# EAGLE board ms2 (EAGLE 6.5.0)
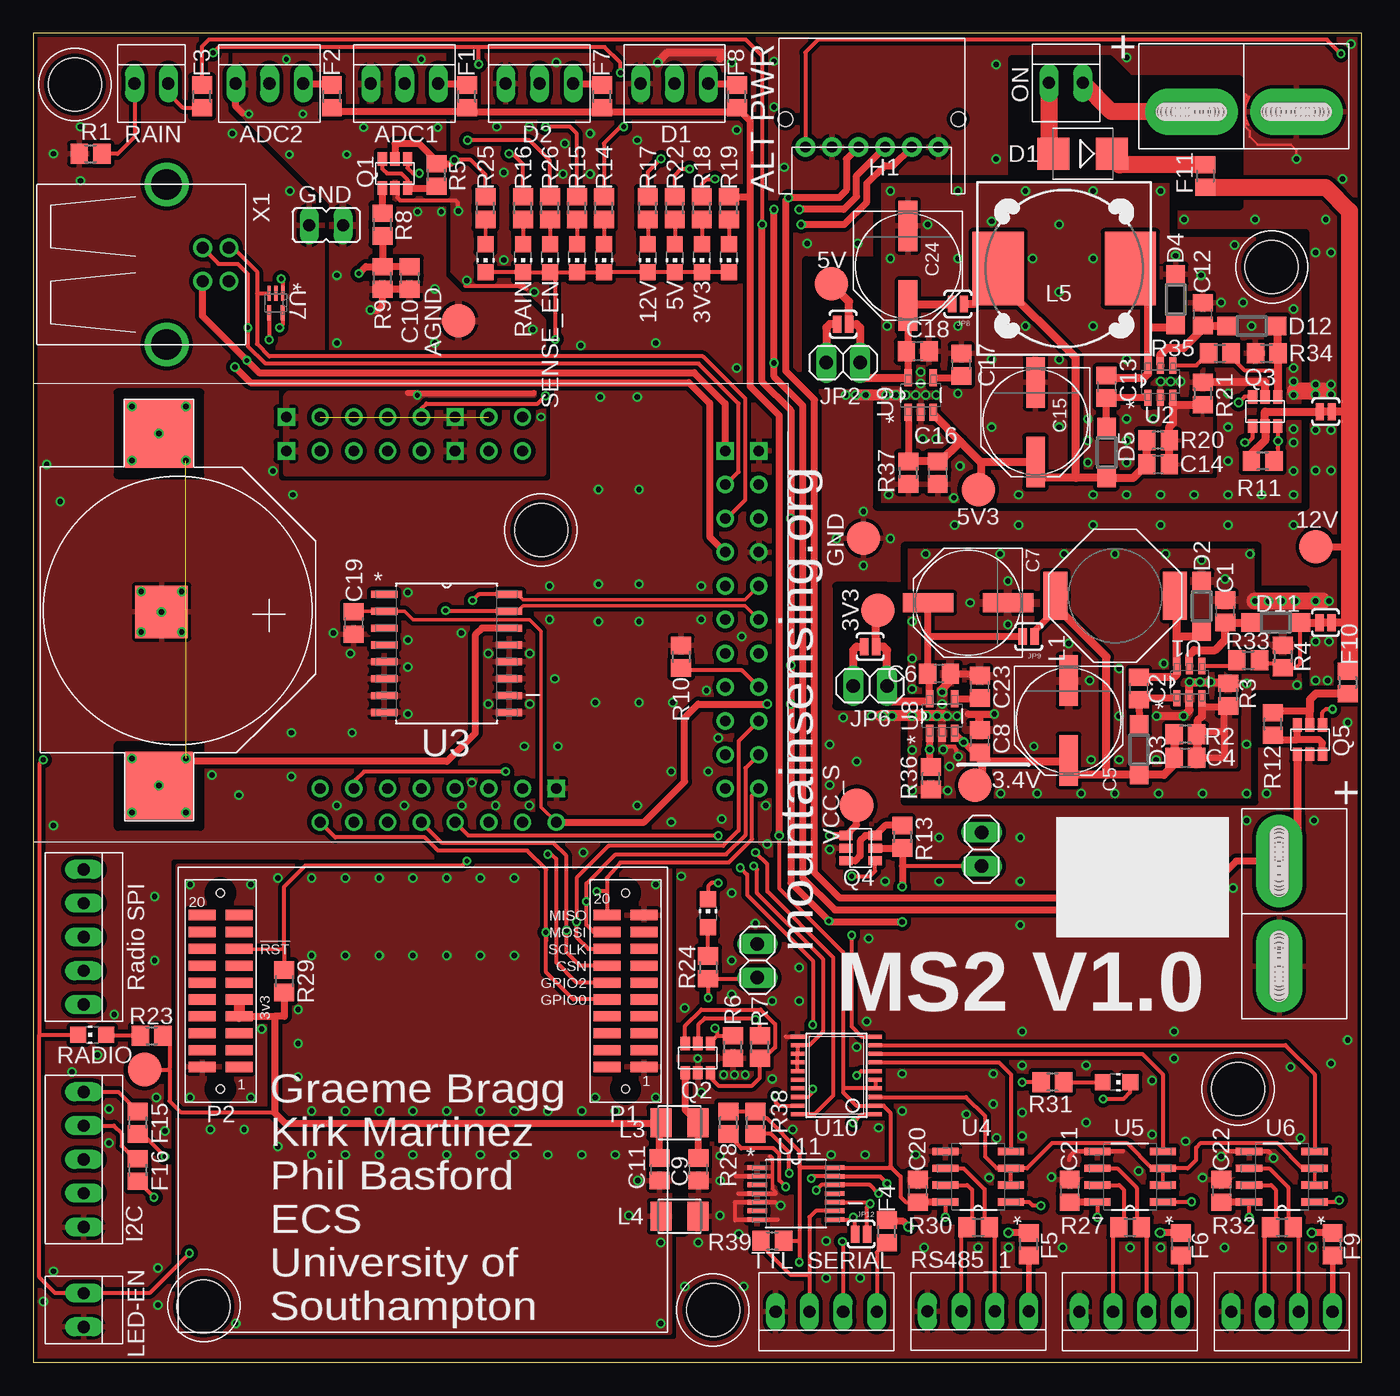
[diagram p4: board, top side]
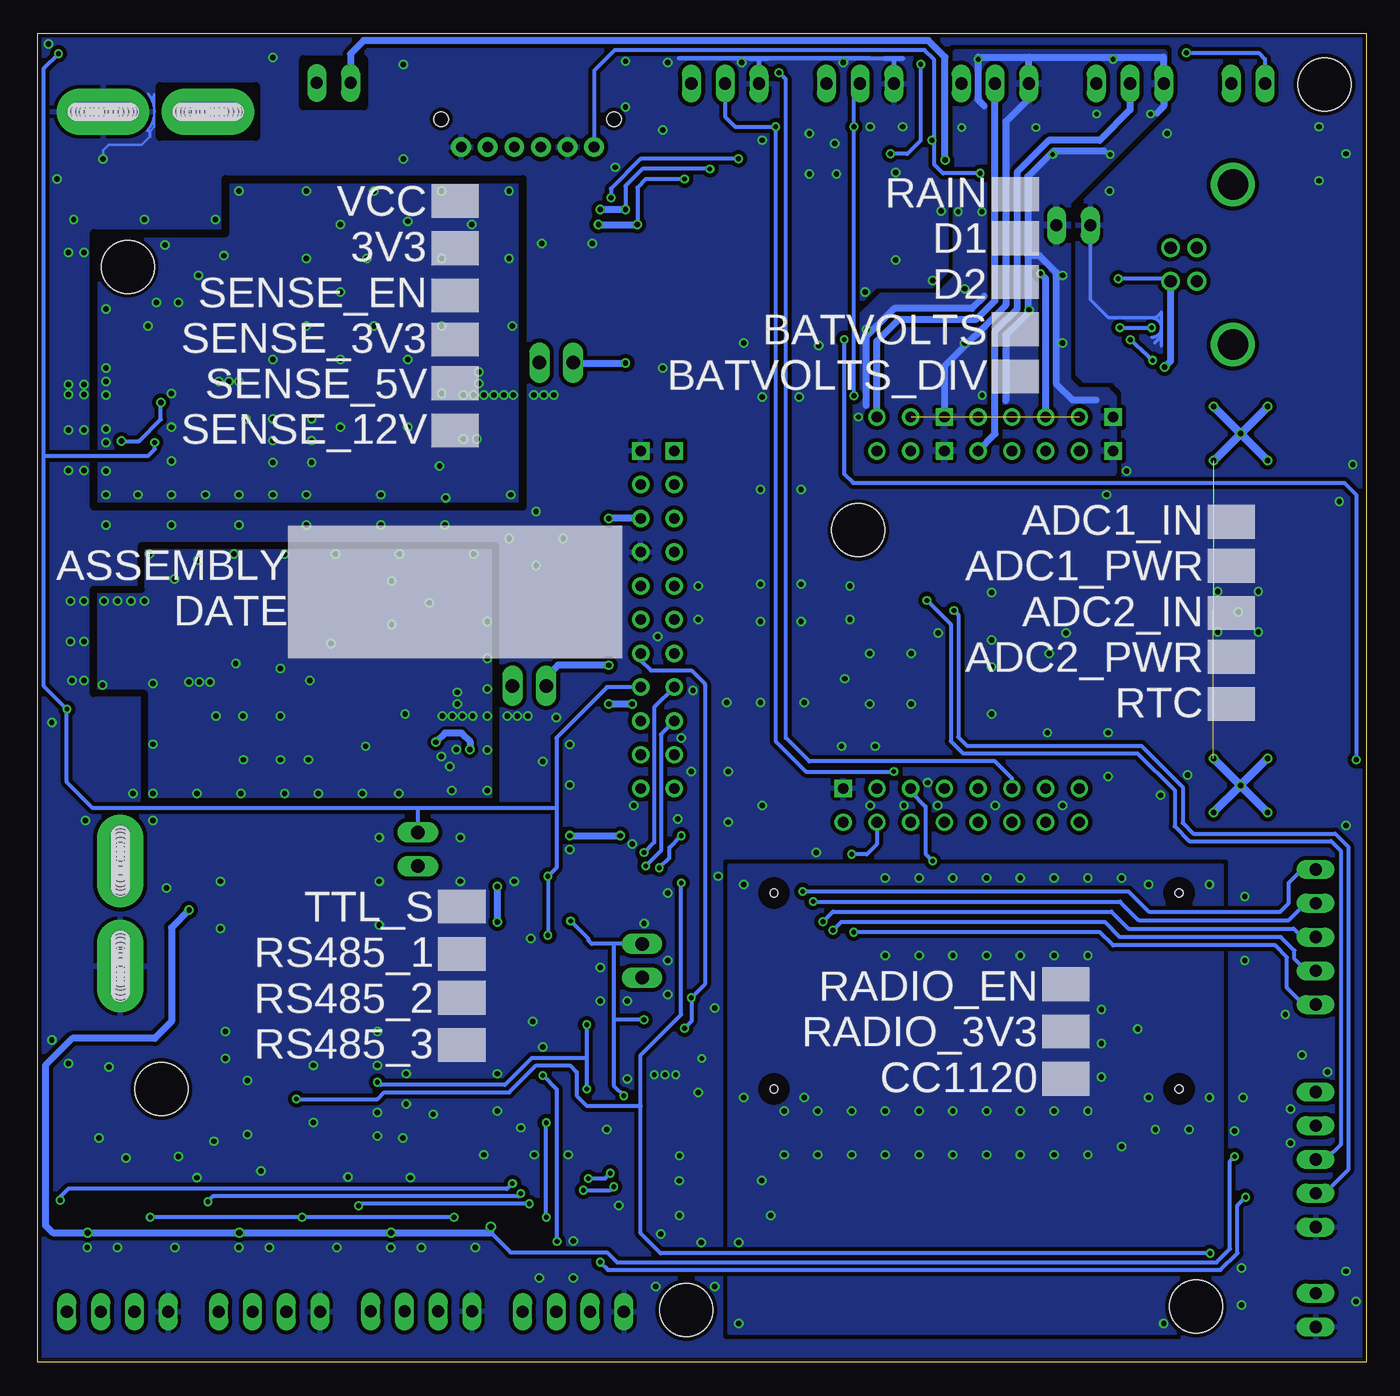
[diagram p5: board, bottom side, seen from below]

Size 100 x 100 mm. Coordinates in mm from the lower left corner, seen from the top.
Outline: 0,0 100,0 100,100 0,100 0,0
Copper layers (1*16): Top 0.035mm / dielectric 1.5mm / Bottom 0.035mm
Design rules "dirt_cheap_dirty_boards.v1 *": minimum track width 5mil, minimum drill 12mil, track to track 5mil, track to pad 5mil, pad to pad 5mil, via to via 5mil, smd to smd 0mil, copper to edge 10mil, drill to drill 10mil, minimum pad ring 10mil, minimum via ring 6mil, stop-mask expansion 0mil, vias tented up to drill 25mil, thermal gap 10mil
Net classes: 1 usb: width 0.305 mm, drill 0.356 mm, clearance 0.152 mm; 2 rs485: width 0.305 mm, drill 0.356 mm, clearance 0.305 mm
Holes 4 mm at 90.68,20.57 12.83,4.19 93.22,82.42 3.15,96.14 51.18,3.94 38.23,62.61
tRestrict: area 73.7,87 to 90.8,98; area 84.3,78.1 to 86.6,81.2; area 48.4,9.8 to 49,19.2; 32 lines
bRestrict: area 75.4,94.5 to 80,98; area 83.6,92.2 to 90.8,96; 14 lines

## Footprints (pad centres in the part's own frame; a part is rotated, then mirrored left to right if it is on the bottom)
B2,54 = smd 2.54 x 2.54: TP 0,0
POWERPOLE_PAIR_45A = drill 1.27 pad 3.5 long: BLACK 3.95,-1.15; RED -3.95,-1.15 | hole 1.27: -1.97,-1.15; -5.93,-1.15; 1.97,-1.15; 5.93,-1.15; -4.66,-1.15; -3.39,-1.15; 3.24,-1.15; 4.66,-1.15; -5.676,-1.15; -5.803,-1.15; -5.549,-1.15; -5.422,-1.15; -5.295,-1.15; -5.168,-1.15; -5.041,-1.15; -4.914,-1.15; -4.787,-1.15; -2.097,-1.15; -2.224,-1.15; -2.351,-1.15; -2.478,-1.15; -2.605,-1.15; -2.732,-1.15; -2.986,-1.15; -2.859,-1.15; -3.113,-1.15; -3.24,-1.15; -3.517,-1.15; -3.644,-1.15; -3.771,-1.15; -3.898,-1.15; -4.025,-1.15; -4.152,-1.15; -4.279,-1.15; -4.406,-1.15; -4.533,-1.15; 5.803,-1.15; 5.676,-1.15; 5.549,-1.15; 5.422,-1.15; 5.295,-1.15; 5.168,-1.15; 5.041,-1.15; 4.914,-1.15; 4.787,-1.15; 4.533,-1.15; 4.406,-1.15; 4.279,-1.15; 4.025,-1.15; 4.025,-1.15; 4.152,-1.15; 3.898,-1.15; 3.771,-1.15; 3.771,-1.15; 3.644,-1.15; 3.644,-1.15; 3.644,-1.15; 3.517,-1.15; 3.517,-1.15; 3.39,-1.15; 3.113,-1.15; 2.986,-1.15; 2.859,-1.15; 2.732,-1.15; 2.605,-1.15; 2.478,-1.15; 2.351,-1.15; 2.224,-1.15; 2.097,-1.15
C0805 = smd 1.3 x 1.5: 1 -0.85,0; 2 0.85,0
PANASONIC_E = smd 3.8 x 1.4: + 3,0; - -3,0
SMB = smd 2.4 x 2.4: A 2.2,0; C -2.2,0
SOD123 = smd 1.4 x 1.4: A 1.9,0; C -1.9,0
0805 = smd 1.3 x 1.5: 1 -0.85,0; 2 0.85,0
JST-PA-6-SE = drill 0.8 pad 1.5: 1 5,0; 2 3,0; 3 1,0; 4 -1,0; 5 -3,0; 6 -5,0 | hole 1.1: 6.5,2.1; -6.5,2.1
2-MOLEX = drill 0.914 long: 1 -1.27,-0.381; 2 1.27,-0.381
3-MOLEX = drill 0.914 long: 1 -2.54,0; 2 0,0; 3 2.54,0
4-MOLEX = drill 0.914 long: 1 -2.667,-0.381; 2 -0.127,-0.381; 3 2.413,-0.381; 4 4.953,-0.381
5-MOLEX = drill 0.914 long: 1 -3.937,-0.127; 2 -1.397,-0.127; 3 1.143,-0.127; 4 3.683,-0.127; 5 6.223,-0.127
1X02 = drill 1.016 long: 1 -1.27,0; 2 1.27,0
SJ_2S-NO = smd 0.635 x 1.27: 1 -0.45,0; 2 0.45,0
JP1 = drill 0.914 long: 1 0,-1.27; 2 0,1.27
1048 = smd 1.8 x 3.6: 1 -4.5,0; 2 4.5,0
L3230M = smd 1.6 x 2.2: 1 -1.4,0; 2 1.4,0
DR127 = smd 3.85 x 5.5: 1 -4.975,0; 2 4.975,0
CHIP-LED0805 = smd 1.2 x 1.2: A 0,-1.05; C 0,1.05
TSOT26 = smd 0.7 x 1: P$1 0.4,-1.9; P$2 1.35,-1.9; P$3 2.3,-1.9; P$4 2.3,0.3; P$5 1.35,0.3; P$6 0.4,0.3
R0805 = smd 1.3 x 1.5: 1 -0.85,0; 2 0.85,0
SOT95P280X100-6N = smd 1.219 x 0.508: 1 -1.219,0.94; 2 -1.219,0; 3 -1.219,-0.94; 4 1.219,-0.94; 5 1.219,0; 6 1.219,0.94
SOIC127P1032X265-16N = smd 1.981 x 0.533: 1 -4.699,4.445; 2 -4.699,3.175; 3 -4.699,1.905; 4 -4.699,0.635; 5 -4.699,-0.635; 6 -4.699,-1.905; 7 -4.699,-3.175; 8 -4.699,-4.445; 9 4.699,-4.445; 10 4.699,-3.175; 11 4.699,-1.905; 12 4.699,-0.635; 13 4.699,0.635; 14 4.699,1.905; 15 4.699,3.175; 16 4.699,4.445
SOIC127P600X175-8N = smd 1.981 x 0.559: 1 -2.464,1.905; 2 -2.464,0.635; 3 -2.464,-0.635; 4 -2.464,-1.905; 5 2.464,-1.905; 6 2.464,-0.635; 7 2.464,0.635; 8 2.464,1.905
SOT50P160X60-5N = smd 1.118 x 0.254: 1 -0.737,0.508; 2 -0.737,0; 3 -0.737,-0.508 | smd 1.118 x 0.305: 4 0.737,-0.508; 5 0.737,0.508
SOT95P280X145-5N = smd 1.27 x 0.559: 1 -1.295,0.94; 2 -1.295,0; 3 -1.295,-0.94; 4 1.295,-0.94; 5 1.295,0.94
TSSOP20 = smd 0.305 x 0.991: 1 -2.925,-2.918; 2 -2.275,-2.918; 3 -1.625,-2.918; 4 -0.975,-2.918; 5 -0.325,-2.918; 6 0.325,-2.918; 7 0.975,-2.918; 8 1.625,-2.918; 9 2.275,-2.918; 10 2.925,-2.918; 11 2.925,2.918; 12 2.275,2.918; 13 1.625,2.918; 14 0.975,2.918; 15 0.325,2.918; 16 -0.325,2.918; 17 -0.975,2.918; 18 -1.625,2.918; 19 -2.275,2.918; 20 -2.925,2.918
SOP65P640X120-14N = smd 1.473 x 0.356: 1 -2.921,1.956; 2 -2.921,1.295; 3 -2.921,0.66; 4 -2.921,0; 5 -2.921,-0.66; 6 -2.921,-1.295; 7 -2.921,-1.956; 8 2.921,-1.956; 9 2.921,-1.295; 10 2.921,-0.66; 11 2.921,0; 12 2.921,0.66; 13 2.921,1.295; 14 2.921,1.956
CR2016 = smd 3.962 x 3.962: GND -1.7,8.63 | smd 5.08 x 5.08: V+@1 -14.765,8.812; V+@2 11.7,8.83
CC1120-HEADERS-SMT = smd 2.032 x 0.762: 3V3-1 13.97,1.905; 3V3-2 13.97,0.635; CSN -13.716,-1.905; GND -16.51,-5.715; GND1 -16.51,5.715; GND2 16.764,5.715; GPIO0 -13.716,0.635; GPIO2 -13.716,-0.635; GPIO3 16.764,-4.445; MISO -13.716,-5.715; MOSI -13.716,-4.445; P$2 -16.51,4.445; P$3 -16.51,3.175; P$4 -16.51,1.905; P$5 -16.51,0.635; P$6 -16.51,-0.635; P$7 -16.51,-1.905; P$8 -16.51,-3.175; P$9 -16.51,-4.445; P$11 -13.716,5.715; P$12 -13.716,4.445; P$13 -13.716,3.175; P$14 -13.716,1.905; P$21 13.97,5.715; P$22 13.97,4.445; P$23 13.97,3.175; P$26 13.97,-0.635; P$27 13.97,-1.905; P$29 13.97,-4.445; P$30 13.97,-5.715; P$32 16.764,4.445; P$33 16.764,3.175; P$34 16.764,1.905; P$35 16.764,0.635; P$36 16.764,-0.635; P$37 16.764,-1.905; P$38 16.764,-3.175; P$40 16.764,-5.715; RESET 13.97,-3.175; SCLK -13.716,-3.175 | hole 0.6: -15.113,7.366; 15.367,7.366; -15.113,-7.366; 15.367,-7.366
USB-B-H = drill 0.914: D+ 0,1.25; D- 1.981,1.25; GND 0,-1.25; VBUS 1.981,-1.25 | drill 2.286: P$1 -2.718,-6.02; P$2 -2.718,6.02
Z1 = drill 0.8 square: A1 17.78,-5.08; A2 17.78,-2.54; A11 30.48,-5.08; A12 30.48,-2.54; B17 50.8,-5.08; B18 53.34,-5.08; C39 38.1,-30.48 | drill 0.8: A3 20.32,-5.08; A4 20.32,-2.54; A5 22.86,-5.08; A6 22.86,-2.54; A7 25.4,-5.08; A8 25.4,-2.54; A9 27.94,-5.08; A10 27.94,-2.54; A13 33.02,-5.08; A14 33.02,-2.54; A15 35.56,-5.08; A16 35.56,-2.54; B19 50.8,-7.62; B20 53.34,-7.62; B21 50.8,-10.16; B22 53.34,-10.16; B23 50.8,-12.7; B24 53.34,-12.7; B25 50.8,-15.24; B26 53.34,-15.24; B27 50.8,-17.78; B28 53.34,-17.78; B29 50.8,-20.32; B30 53.34,-20.32; B31 50.8,-22.86; B32 53.34,-22.86; B33 50.8,-25.4; B34 53.34,-25.4; B35 50.8,-27.94; B36 53.34,-27.94; B37 50.8,-30.48; B40 53.34,-30.48; C40 38.1,-33.02; C41 35.56,-30.48; C42 35.56,-33.02; C43 33.02,-30.48; C44 33.02,-33.02; C45 30.48,-30.48; C46 30.48,-33.02; C47 27.94,-30.48; C48 27.94,-33.02; C49 25.4,-30.48; C50 25.4,-33.02; C51 22.86,-30.48; C52 22.86,-33.02; C53 20.32,-30.48; C54 20.32,-33.02

## Placement (x,y rotation side)
3.4V  TPB2,54  [B2,54]  70.87,43.43 180 top
3V3  TPB2,54  [B2,54]  63.58,56.59 180 top
5V  5V B  [B2,54]  60.07,81.15 180 top
5V3  5V B  [B2,54]  71.12,65.66 180 top
12V  TPB2,54  [B2,54]  96.52,61.37 0 top
12V_OUT  POWERPOLE_POWER45A  [POWERPOLE_PAIR_45A]  94.92,33.76 270 top
AGND  TPB2,54  [B2,54]  32,78.36 0 top
C1  2.2uF  [C0805]  89.71,56.52 90 top
C2  0.22uF  [C0805]  83.21,50.7 90 top
C4  10pF  [C0805]  86.72,45.49 0 top
C5  100uF  [PANASONIC_E]  77.93,48.29 270 top
C6  2.2uF  [C0805]  68.17,51.82 0 top
C7  100uF  [PANASONIC_E]  70.36,57.15 180 top
C8  1uF  [C0805]  71.25,46.74 90 top
C9  100nF  [C0805]  50.06,14.53 270 top
C10  1uF  [C0805]  28.33,81.58 270 top
C11  100nF  [C0805]  47.14,14.53 270 top
C12  2.2uF  [C0805]  88.01,78.87 90 top
C13  0.22uF  [C0805]  80.77,73.41 90 top
C14  10pF  [C0805]  84.66,67.56 0 top
C15  68uF  [PANASONIC_E]  75.44,70.74 270 top
C16  1uF  [C0805]  68.07,66.93 270 top
C17  0.1uF  [C0805]  69.85,75.06 90 top
C18  2.2uF  [C0805]  66.57,76.07 0 top
C19  100nF  [C0805]  24.13,55.63 90 top
C20  100nF  [C0805]  66.57,12.9 90 top
C21  100nF  [C0805]  78,12.9 90 top
C22  100nF  [C0805]  89.43,12.9 90 top
C23  0.1uF  [C0805]  71.25,50.83 90 top
C24  100uF  [PANASONIC_E]  65.84,82.5 270 top
D1  [SMB]  78.99,90.93 180 top
D2  MBR0540  [SOD123]  87.93,56.9 90 top
D3  MBR0540  [SOD123]  83.24,46.1 270 top
D4  MBR0540  [SOD123]  85.98,79.96 90 top
D5  MBR0540  [SOD123]  80.77,68.45 270 top
D11  MBR0530T1G  [SOD123]  93.52,55.65 0 top
D12  MBR0530T1G  [SOD123]  91.72,77.98 0 top
F1  MCF0805  [0805]  32.64,95.25 90 top
F2  MCF0805  [0805]  22.48,95.25 90 top
F3  MCF0805  [0805]  12.7,95.25 90 top
F4  MCF0805  [0805]  64.24,9.86 90 top
F5  MCF0805  [0805]  74.93,8.89 90 top
F6  MCF0805  [0805]  86.36,8.89 90 top
F7  MCF0805  [0805]  42.8,95.25 90 top
F8  MCF0805  [0805]  52.96,95.25 90 top
F9  MCF0805  [0805]  97.79,8.89 90 top
F10  MCF0805  [0805]  98.93,51.16 270 top
F11  MCF0805  [0805]  88.21,89.26 270 top
F15  MCF0805  [0805]  7.87,18.03 270 top
F16  MCF0805  [0805]  7.87,14.48 270 top
GND  5V B  [B2,54]  62.48,61.99 0 top
H1  JST-S06B-PASK-2  [JST-PA-6-SE]  63.12,91.44 0 top
J1  POWERPOLE_POWER45A  [POWERPOLE_PAIR_45A]  91.12,95.25 0 top
J2  RAIN  [2-MOLEX]  8.89,95.83 180 top
J3  ADC1  [3-MOLEX]  27.94,96.22 180 top
J4  ON  [2-MOLEX]  77.72,95.89 180 top
J5  D1  [3-MOLEX]  48.26,96.22 180 top
J6  D2  [3-MOLEX]  38.1,96.22 180 top
J7  ADC2  [3-MOLEX]  17.78,96.22 180 top
J8  LED-EN  [2-MOLEX]  3.43,3.94 90 top
J9  RS485_2  [4-MOLEX]  81.41,4.19 0 top
J10  RS485_1  [4-MOLEX]  69.98,4.22 0 top
J11  I2C  [5-MOLEX]  3.68,14.12 90 top
J12  TTL_SERIAL  [4-MOLEX]  58.55,4.19 0 top
J13  Radio SPI  [5-MOLEX]  3.68,30.86 90 top
J14  RS485_3  [4-MOLEX]  92.84,4.19 0 top
JP1  SENSE_EN  [1X02]  71.37,38.61 90 top
JP2  5V Out EN  [1X02]  60.96,75.21 0 top
JP3  [SJ_2S-NO]  62.99,53.85 180 top
JP4  [SJ_2S-NO]  97.26,55.65 0 top
JP5  LINK  [JP1]  22.05,85.55 270 top
JP6  3.3V Out EN  [1X02]  62.99,50.9 180 top
JP7  [SJ_2S-NO]  60.96,78.11 180 top
JP8  [SJ_2S-NO]  69.6,79.63 180 top
JP9  [SJ_2S-NO]  74.93,54.61 180 top
JP10  [SJ_2S-NO]  97.28,71.53 0 top
JP11  RADIO_EN  [1X02]  54.51,30.23 270 top
JP12  [SJ_2S-NO]  62.31,9.65 180 top
L1  47uH  [1048]  81.43,57.68 180 top
L3  10mH  [L3230M]  48.64,18.03 0 top
L4  10mH  [L3230M]  48.64,11 0 top
L5  68uH  [DR127]  77.6,82.3 180 top
LED1  D1  [CHIP-LED0805]  42.95,83.08 180 top
LED2  D2  [CHIP-LED0805]  40.92,83.08 180 top
LED3  RAIN  [CHIP-LED0805]  36.86,83.08 180 top
LED4  12V  [CHIP-LED0805]  46.25,83.08 180 top
LED5  3V3  [CHIP-LED0805]  50.32,83.08 180 top
LED6  SENSE  [CHIP-LED0805]  52.35,83.08 180 top
LED7  5V  [CHIP-LED0805]  48.29,83.08 180 top
LED8  RADIO  [CHIP-LED0805]  4.45,24.64 90 top
LED9  RADIO_EN  [CHIP-LED0805]  50.8,33.78 0 top
LED10  VCC  [CHIP-LED0805]  34.04,83.08 180 top
LED11  SENSE_EN  [CHIP-LED0805]  38.89,83.08 180 top
LED12  TXEN  [CHIP-LED0805]  81.53,21.08 270 top
Q1  DMG6602SVT  [TSOT26]  28.57,88.65 180 top
Q2  DMG6602SVT  [TSOT26]  51.37,22.1 180 top
Q3  DMG6602SVT  [TSOT26]  91.36,72.34 0 top
Q4  DMG6602SVT  [TSOT26]  61.47,37.34 90 top
Q5  DMG6602SVT  [TSOT26]  97.43,46.05 180 top
R1  100K  [R0805]  4.32,90.93 0 top
R2  1M  [R0805]  86.72,47.24 180 top
R3  562K  [R0805]  89.94,50.24 270 top
R4  1M  [R0805]  94.06,53.11 270 top
R5  100K  [R0805]  30.35,89.33 90 top
R6  100K  [R0805]  52.65,23.72 90 top
R7  100K  [R0805]  54.69,23.72 90 top
R8  1K 0.1%  [R0805]  26.29,85.6 90 top
R9  200R 0.1%  [R0805]  26.29,81.58 90 top
R10  100K  [R0805]  48.77,53.09 270 top
R11  100K  [R0805]  92.53,67.82 180 top
R12  100K  [R0805]  93.29,48.03 90 top
R13  100K  [R0805]  65.41,39.55 270 top
R14  56  [R0805]  42.95,86.84 90 top
R15  56  [R0805]  40.92,86.84 90 top
R16  56  [R0805]  36.86,86.84 90 top
R17  560  [R0805]  46.25,86.84 90 top
R18  56  [R0805]  50.32,86.84 90 top
R19  56  [R0805]  52.35,86.84 90 top
R20  1M  [R0805]  84.66,69.37 180 top
R21  332K  [R0805]  88.01,72.9 270 top
R22  150  [R0805]  48.29,86.84 90 top
R23  56  [R0805]  8.92,24.57 0 top
R24  56  [R0805]  50.8,29.72 270 top
R25  560  [R0805]  34.04,86.84 90 top
R26  56  [R0805]  38.89,86.84 90 top
R27  120  [R0805]  82.55,10.16 0 top
R28  100K  [R0805]  52.32,18.03 90 top
R29  1K  [R0805]  18.9,28.68 270 top
R30  120  [R0805]  71.12,10.16 0 top
R31  56  [R0805]  76.71,21.08 180 top
R32  120  [R0805]  93.98,10.16 0 top
R33  100K  [R0805]  91.44,52.83 0 top
R34  1M  [R0805]  92.84,75.92 0 top
R35  100K  [R0805]  89.31,75.92 0 top
R36  1M  [R0805]  67.56,43.94 90 top
R37  1M  [R0805]  65.86,66.93 90 top
R38  100K  [R0805]  54.36,18.03 90 top
R39  100K  [R0805]  55.63,9.14 0 top
RADIO_VCC  TPB2,54  [B2,54]  8.38,22.03 0 top
U1  LT1934ES6TRMPBF  [SOT95P280X100-6N]  87.02,51.18 90 top
U2  LT1934ES6TRMPBF  [SOT95P280X100-6N]  84.84,73.79 90 top
U3  DS3231SN  [SOIC127P1032X265-16N]  31.11,53.34 0 top
U4  ISL3179EIBZ  [SOIC127P600X175-8N]  71.12,13.97 180 top
U5  ISL3179EIBZ  [SOIC127P600X175-8N]  82.55,13.97 180 top
U6  ISL3179EIBZ  [SOIC127P600X175-8N]  93.98,13.97 180 top
U7  TPD2E001IDRLRQ1  [SOT50P160X60-5N]  18.26,79.71 270 top
U8  TPS79333DBVR  [SOT95P280X145-5N]  68.4,48.64 90 top
U9  TPS79333DBVR  [SOT95P280X145-5N]  66.8,72.77 90 top
U10  TXS0108E  [TSSOP20]  60.45,21.59 90 top
U11  SN74HC21PW  [SOP65P640X120-14N]  57.4,12.7 0 top
U$3  BUTTON_CELL_NEW  [CR2016]  18.29,58.17 90 top
U$8  CC1120-HEADER-SMT  [CC1120-HEADERS-SMT]  29.46,27.94 180 top
VCC_S  TPB2,54  [B2,54]  61.98,41.91 180 top
X1  67068-9000  [USB-B-H]  12.75,82.6 0 top
Z1  Z1  [Z1]  1.27,73.66 0 top

## Tracks (layer width: path | path; a pad name or v marks a point on that pad's centre or on a via)
5V3
  Top 0.508: U9.1 R37.2 | 67.82,71.25 67.74,71.32 U9.3
  Top 0.61: R20.2 C14.1 82.8,66.55 D5.A 78.49,66.55 | 78.49,66.55 76.07,66.55 75.44,67.18 C15.+ 71.33,67.74 | L5.2 72.62,81.43 | 72.62,81.43 78.44,75.62 78.44,66.6 78.49,66.55 | 71.33,67.74 69.79,69.28 | 69.79,69.28 67.82,71.25 | 71.33,67.74 71.33,65.91 5V3.TP | JP8.1 70.82,79.63 72.62,81.43 | 69.79,69.28 68.29,67.78 C16.1 R37.2
485_RX_1  (via drill 0.36)
  Top 0.305: v75.84,11.79 75.23,11.79 74.95,12.06 U4.1 | U11.10 62.89,12.04 v62.99,11.94 62.76,11.7 JP12.1
  Bottom 0.305: v62.99,11.94 75.69,11.94 v75.84,11.79
485_RX_2  (via drill 0.36)
  Top 0.305: v87.17,12.09 87.15,12.06 U5.1 | v63.63,12.7 62.97,13.36 U11.12 59.33,13.36 v58.93,12.95 | v56.64,13.21 56.16,13.69 56.16,15.65 55.7,16.1 53.29,16.1 52.32,17.07 R28.1
  Bottom 0.305: v63.63,12.7 63.83,12.5 86.82,12.5 87.17,12.14 v87.17,12.09 | v58.93,12.95 56.9,12.95 v56.64,13.21
485_RX_3  (via drill 0.36)
  Top 0.305: v98.3,12.19 98.17,12.06 U6.1 | v64.26,13.46 63.73,13.99 U11.13 58.7,13.99 v58.55,13.84 | v56.9,14.22 56.9,15.8 55.51,17.18 R38.1
  Bottom 0.305: v64.26,13.46 64.67,13.06 97.69,13.06 98.3,12.45 v98.3,12.19 | v58.55,13.84 57.28,13.84 v56.9,14.22
485_TX_1
  Top 0.305: U10.7 72.69,22.57 73.58,21.67 U4.4
485_TX_2
  Top 0.305: U10.8 83.47,23.21 85.01,21.67 U5.4
485_TX_3
  Top 0.305: U10.9 94.25,23.86 96.44,21.67 U6.4
+3V3  (via drill 0.36, 0.41, 0.41 pad 0.61)
  Top 0.254: C19.2 24.04,56.52 U3.2 27.94,56.52 28.57,55.88 37.34,55.88 38.23,54.99 38.23,41.78 Z1.C40
  Top 0.305: Q2.P$2 50.04,24.02 50.04,25.4 50.55,25.91 54.23,25.91 v54.36,25.78 54.69,25.45 R7.2 | R18.2 50.32,88.67 50.67,89.03 v51.31,89.03 | F3.2 12.7,99.01 13.23,99.54 53.62,99.54 54.86,98.3 v54.86,85.6 | JP1.1 65.41,37.34 | v55.88,20.07 55.88,19.56 56.12,19.32 U10.19
  Top 0.508: Z1.C40 45.97,40.64 49.02,43.69 49.02,48.51 50.04,49.53 v55.24,49.53 | v65.41,33.15 59.94,33.15 v59.88,33.21 57.02,36.07 v57.02,49.53 v57.02,52.45 v57.02,63.5 57.02,71.63 54.86,73.79 v54.86,85.6 | Q4.P$2 65.39,38.69 | 65.39,38.69 R13.2 | 65.39,38.69 65.41,38.68 65.41,37.34 v65.41,35.81 | H1.2 64.72,90.04 64.08,90.04 62.74,88.7 62.74,87.3 61.04,85.6 v57.78,85.6
  Top 0.61: JP6.2 61.72,53.59 61.98,53.85 JP3.2
  Bottom 0.305: v59.88,33.21 58.55,31.88 58.55,31.75 58.29,31.5 56.64,31.5 | 54.74,85.47 v54.86,85.6 54.86,88.39 54.23,89.03 v51.31,89.03 | JP11.1 56.64,31.5 | 56.64,31.5 56.64,25.78 | 56.64,25.78 56.64,20.83 v55.88,20.07 | v54.36,25.78 56.64,25.78
  Bottom 0.508: 61.7,50.93 JP6.2 61.72,51.56 60.83,52.45 v57.02,52.45 | Z1.B22 v57.02,63.5 | v55.24,49.53 v57.02,49.53 | v65.41,35.81 v65.41,33.15 | v57.78,85.6 v54.86,85.6
+3V4  (via drill 0.41 pad 0.61)
  Top 0.508: C8.1 70.8,45.89 v70.03,46.66 U8.3 | U8.1 v67.46,46.1 67.46,45.15 R36.2 | JP9.1 75.38,55.06 76.96,56.64
  Top 0.61: 80.77,44.2 80.77,53.09 77.22,56.64 | 77.22,56.64 77.22,57.65 | R2.2 C4.1 85.97,45.07 85.09,44.2 D3.A 80.77,44.2 | 80.77,44.2 77.93,44.2 C5.+ 77.93,45.21 | 71.41,45.21 77.93,45.21 | 77.93,45.21 77.98,45.21 | C8.1 71.25,45.38 71.41,45.21 | 71.41,45.21 71.41,44.23 3.4V.TP | 76.96,56.64 77.22,56.64
  Top 1.27: L1.2 77.22,57.68 77.22,57.65
  Bottom 0.508: v67.46,46.1 67.46,46.74 68.07,47.35 U8.3 v70.03,46.66
+12V
  Top 0.305: D11.A 95.35,55.32 95.35,52.58 95.03,52.26 R4.2 93.98,52.34 93.98,52.58 92.71,52.58 92.46,52.83 R33.2 | 99.06,52.2 99.06,52.13 F10.1 | Q3.P$2
  Top 0.508: 12V.TP 98.91,61.37 99.06,61.21
  Top 0.61: Q3.P$2 92.71,69.37 91.66,68.31 R11.2 | D11.A JP4.1 JP4.2 99.06,55.65 | Q3.P$2 92.71,71.53 JP10.1 JP10.2 99.06,71.53
  Top 1.27: 99.06,52.2 99.06,55.65 99.06,61.21 99.06,71.53 99.06,86.61 97.27,88.41 F11.2
ADC_1
  Bottom 0.508: Z1.A16 36.83,76.83 35.18,78.49 29.34,78.49 27.94,79.88 J3.2
ADC_2
  Bottom 0.508: J7.2 17.78,94.23 20.07,91.95 23.88,91.95 26.29,89.53 26.29,79.25 27.94,77.6 27.94,69.85 Z1.A9
ADC_7  (via drill 0.36)
  Top 0.508: R8.1 R9.2 | v24.51,81.92 25.03,82.44 R9.2 | C10.1 R9.2
  Bottom 0.508: Z1.A6 24.13,81.53 v24.51,81.92
DIO_1  (via drill 0.36)
  Top 0.305: R14.2 42.95,91.72 44.2,92.96 v44.45,92.96 | v35.56,44.45 24.89,44.45 24.13,43.69 Z1.C51
  Bottom 0.305: J5.2 48.26,93.73 47.5,92.96 v44.45,92.96 44.45,46.74 42.16,44.45 v35.56,44.45
DIO_2  (via drill 0.36)
  Top 0.305: Z1.A10 29.21,71.75 29.59,72.14 37.97,72.14 v38.56,72.72 | R15.2 40.92,92.43 40.39,92.96 v38.56,92.96
  Bottom 0.305: J6.2 38.56,95.76 v38.56,92.96 v38.56,72.72
GND  (via drill 0.36, 0.41 pad 0.61)
  Top 0.203: 91.47,93.12 arc-62 91.54,95.22 91.39,95.22 91.21,95.4 | 91.21,95.38 91.21,92.96 91.57,92.61 91.57,92.2 92.15,91.62 94.64,91.62 95.07,91.19 v95.07,90.53
  Top 0.254: U10.11 57.63,24.51 | 55.4,15.52 arc-90 55.65,15.27 55.65,13.08 55.88,12.85 55.88,12.7 | 52.83,12.04 52.83,10.67 52.91,10.74 U11.7
  Top 0.305: 69.47,46 69.34,46.33 68.58,46.33 68.48,46.23 v68.48,46.1 | Q1.P$5 27.23,88.19 27.41,88.01 27.41,87.63 27.61,87.43 31.8,87.43 31.95,87.27 31.95,86.67 v32,86.61 | 36.91,80.97 36.58,80.97 | 36.58,80.97 32.51,80.97 | 36.58,80.97 37.11,80.77 | 56.62,24.51 57.63,24.51 | 78.61,15.88 arc90 77.98,15.24
  Top 0.356: 53.09,12.7 55.88,12.7 | 52.83,12.04 54.38,12.04 U11.5 55.88,12.04 | 52.96,10.74 U11.7 56.01,10.74 | 52.91,13.99 55.6,13.99 | 78.61,15.88 U5.5 82.02,15.88 | v89.41,15.49 89.79,15.88 U6.5 92.96,15.88 93.4,15.44
  Top 0.508: 89.69,51.18 R3.1 | v87.02,51.18 87.02,51.13 | C6.2 71.11,51.82 C23.2 | 70.36,48.77 72.39,48.77 | 68.3,50.57 68.4,50.47 v68.4,50.42 68.53,50.55 68.56,50.55 | 68.56,50.8 68.56,50.55 | 68.56,50.55 68.56,50.29
  Top 0.61: 87.02,51.13 U1.2 87.02,49.07 v86.59,48.64 v84.56,48.64 | v87.02,51.18 89.69,51.18 | 71.22,48.72 71.22,47.5 71.25,47.52 C8.2 | 68.3,50.57 69.06,51.33 | Q3.P$5 92.71,73.75 R21.1 | v46.99,97.79 47.75,98.55 51.82,98.55 51.71,98.45 51.71,98.11
  Top 0.813: 68.58,48.64 63.75,48.64 | 65.28,72.77 61.98,72.77
  Top 1.27: 97.03,57.28 v91.95,57.28 | 95.02,73.1 97.05,73.1
  Bottom 0.203: 91.21,95.4 91.21,95.12 | 91.21,95.12 91.21,92.99 | 91.31,95.22 91.21,95.12 | v95.07,90.53 95.07,91.19 94.64,91.62 92.15,91.62 91.57,92.2 | 91.57,92.2 91.54,92.23 91.54,92.63 91.21,92.96 | 91.67,95.45 arc81 91.77,92.66 91.62,92.66 91.57,92.61 91.57,92.2
  Bottom 0.254: 15.42,77.22 15.42,79.02 15.85,78.59 16.15,78.59 | 15.42,77.22 15.42,76.48 | 15.42,77.22 15.93,76.71 | 16.15,77.11 arc-180 16.15,78.59 | JP5.1 20.78,79.96 19.41,78.59 16.15,78.59
  Bottom 0.305: 45.72,98.08 45.72,98.04 | 36.25,98.08 37.57,98.08 37.59,98.11
  Bottom 0.33: 37.39,98.11 37.59,98.11 51.71,98.11
  Bottom 0.356: J6.3 35.56,98.08 35.81,98.08 | J5.3 45.72,98.04
  Bottom 0.381: 34.87,98.08 35.81,98.08 36.25,98.08 | 45.03,98.08 45.72,98.08 46.41,98.08
  other vias: 88.01,42.8 91.31,42.8 91.31,46.51 91.31,51.08 84.71,42.8 81.41,42.8 75.56,42.8 75.31,46.35 79.63,45.34 81.71,45.34 81.71,48.64 81.71,52.2 89.71,58.93 87.93,60.38 93.98,57.28 95,57.28 68.4,49.53 68.02,48.64 72.34,48.77 67.26,48.64 68.99,44.83 69.62,45.59 68.78,48.64 78.87,42.8 72.82,42.8 68.83,43.03 73.36,55.52 79.5,51.31 77.93,54.08 73.36,58.78 70.51,57.15 84.51,45.34 69.55,48.64 67.18,60.83 91.57,60.83 81.41,60.83 72.77,60.83 85.22,60.83 77.6,60.83 88.62,51.18 85.09,52.58 92.96,57.28 66.17,43.03 66.17,46.08 66.17,48.64 66.17,55.75 66.17,52.96 84.84,73.79 85.6,73.79 86.36,73.79 87.83,51.18 82.3,67.69 82.3,69.34 82.3,70.99 79.38,67.69 79.38,70.99 79.38,69.34 66.42,72.77 67.18,72.77 65.66,72.77 67.94,72.77 66.8,73.66 66.8,74.5 84.33,70.99 64.92,72.77 64.19,72.77 66.17,50.67 28.19,54.36 28.19,52.32 28.19,48.77 34.24,53.34 34.24,49.53 28.19,57.91 23.88,53.34 22.61,54.86 9.65,56.46 8.13,57.99 11.18,57.99 11.18,54.94 8.13,54.94 86.61,85.98 91.95,85.98 97.28,85.98 96.52,57.28 97.54,57.28 64.64,48.64 63.88,48.64 63.12,48.64 62.66,72.77 61.9,72.77 61.14,72.77 72.47,97.64 94.87,72.77 96.52,72.82 97.66,72.82 94.87,73.79 94.87,74.8 90.42,84.07 94.87,65.28 64.39,65.28 96.52,73.58 97.66,73.58 84.84,88.14 91.69,77.98 89.41,79.76 94.87,79.25 87.88,81.79 85.98,83.26 91.06,79.76 96.52,83.49 97.66,83.49 96.52,70.15 97.66,70.15 96.52,54.23 97.54,54.23 94.87,70.23 94.87,69.22 94.87,67.06 88.01,13.89 76.63,13.94 59.94,38.58 50.01,22.86 51.97,21.64 53.59,21.64 52.78,21.64 71.93,13.89 95.12,50.95 96.52,51.31 97.41,51.31 34.9,92.96 37.34,92.96 40.01,91.69 52.96,92.71 52.96,74.8 41.2,76.5 37.72,80.52 46.86,76.71 42.29,49.66 85.85,22.86 57.15,17.53 49.02,26.67 55.63,27.18 48.77,36.58 37.39,53.34 37.39,49.53 32.21,54.86 37.34,41.91 32.26,41.91 27.94,41.91 22.86,41.91 51.69,11.05 50.04,9.02 62.74,25.65 51.71,13.67 56.26,11.81 55.75,94.44 55.75,97.89 99.19,99.19 66.95,69.47 69.75,67.44 67.97,69.47 39.37,97.79 41.91,89.41 39.88,89.41 41.91,92.46 52.58,97.79 96.52,67.11 97.66,67.11 35.43,82.93 35.43,89.53 32.64,81.41 45.47,91.95 83.19,14.4 54.36,33.02 52.58,35.31 58.24,84.18 62.05,84.18 64.52,61.98 62.48,64.01 62.48,59.94 60.45,61.98 60.96,48.51 59.94,46.48 48.01,40.64 51.82,40.89 51.56,46.99 50.67,50.55 53.34,54.61 38.86,55.88 38.86,58.42 50.29,55.88 50.29,58.42 19.56,65.28 18.03,67.06 2.03,64.77 1.02,67.56 1.52,90.93 3.56,92.96 3.56,88.9 68.2,39.5 68.2,36.2 64.14,36.2 62.87,31.88 86.23,32.64 86.23,36.2 90.3,35.69 96.39,40.77 91.31,40.77 92.84,42.8 98.93,48.13 98.93,24.26 97.66,22.48 49.02,5.71 53.47,5.71 9.4,4.32 9.4,7.11 0.76,4.57 1.52,6.86 4.83,23.11 6.1,26.16 9.14,35.05 9.14,30.23 1.52,40.39 13.46,44.2 15.49,42.67 42.67,72.64 45.47,72.64 56.52,89.92 14.99,92.46 19.3,88.14 98.55,89.03 82.3,98.17 64.52,88.14 69.6,88.14 74.68,88.14 79.76,88.14 64.52,83.06 64.26,77.98 79.76,83.06 74.68,77.98 79.76,77.98 74.17,65.28 69.29,65.05 79.76,65.28 84.84,65.28 89.92,65.28 89.92,70.36 89.92,72.9 89.92,67.82 92.46,65.28 69.6,72.9 69.6,77.98 69.6,83.06 75.21,83.06 87.38,65.28 82.3,65.28 72.14,70.36 72.14,75.44 77.22,80.52 77.22,85.6 72.14,85.85 67.31,85.6 77.22,70.36 77.22,75.44 82.3,75.44 45.59,49.66 45.59,55.75 45.59,58.55 42.55,58.55 42.55,55.75 19.43,47.37 19.43,44.07 24,47.37 39.5,46.35 36.96,46.35 39.24,51.44 9.91,17.4 9.27,19.94 2.92,21.84 5.71,16.51 5.71,19.05 33.02,43.61 34.8,41.91 41.4,38.35 45.47,41.91 48.01,44.45 48.13,49.66 50.8,44.45 55.24,38.99 55.12,41.91 59.94,43.43 61.98,45.21 74.3,39.5 74.3,36.2 74.3,32.89 77.47,8.64 82.55,8.64 84.84,8.64 93.98,8.64 89.66,8.64 96.27,8.64 73.41,8.64 71.12,8.64 67.06,8.64 59.69,9.14 59.69,6.35 62.23,6.35 79.25,22.35 53.09,9.65 50.29,20.32 79.25,18.03 45.59,65.66 42.55,65.66 72.47,90.53 79.76,62.99 74.17,62.99 69.34,62.99 84.84,62.99 89.92,62.99 94.87,62.99 72.26,21.72 72.26,19.43 65.41,21.72 65.41,18.92 63.63,17.65 60.07,15.62 62.61,15.62 66.42,15.62 70.23,18.67 72.52,16.89 84.2,17.14 84.2,21.21 86.74,16.64 95.38,16.89 94.61,22.23 85.85,24.89 74.42,24.89 74.42,22.35 74.42,18.8 74.42,17.02 57.66,27.18 57.66,29.72 61.98,23.72 93.34,15.37 55.63,21.34 52.58,27.69 52.58,30.23 51.69,15.54
  pour Bottom (isolate 0.305, rank 6): -1.91,104.78 103.76,105.03 103.76,-5.46 -1.91,-5.71
  pour Top (isolate 0.305, rank 6): 0,103.5 101.98,103.25 101.98,-3.43 0,-3.17
  pour Bottom (isolate 0.254, rank 5): 95.76,42.67 95.76,62.74 64.52,62.48 64.52,42.42
  pour Top (isolate 0.254, rank 5): 96.01,41.4 95.76,62.74 64.52,62.48 64.77,41.15
  pour Top (isolate 0.305, rank 2): 97.03,63.88 97.03,90.17 62.74,89.53 62.74,63.88
  pour Bottom (isolate 0.305, rank 2): 96.52,63.37 96.52,90.17 62.74,89.53 62.74,63.37
GNDA  (via drill 0.36, 0.41)
  Top 0.457: 28.91,72.92 37.69,72.92 | v28.91,72.77 28.91,72.92 | 28.91,72.92 28.19,72.92
  Top 0.508: C10.2 R9.1 26.29,79.5 25.96,79.17 v25.38,79.17 | 15.75,93.98 15.24,94.49 15.24,96.27
  Bottom 0.508: Z1.A12 31.75,74.93 27.13,79.55 27.13,93.34 25.4,95.07 J3.3 25.4,98.2 | J7.3 15.24,95.63 | 19.74,91.14 23.55,91.14 25.48,89.2 25.48,83.26 | 25.48,83.26 25.48,79.17 | 28.75,94.51 29.21,94.97 29.21,98.2 25.4,98.2 | 25.4,98.2 15.24,98.2 15.24,96.27 J7.3 | 27.13,72.36 27.13,77.27 25.48,78.92 25.48,79.17 | 28.75,80.21 29.67,79.3 35.51,79.3 37.64,77.17 37.64,72.01 | 20.32,72.39 22.1,72.39 23.32,73.61 23.32,81.99 24.59,83.26 25.48,83.26 | 25.48,79.17 v25.38,79.17 | J7.3 15.24,94.49 15.75,93.98
  other vias: 38.23,71.12 30.71,86.56 28.93,86.56 19.28,90.88 16.23,93.93 20.29,93.93 30.45,92.91 24.87,92.91 29.21,98.04 19.05,98.04 22.86,76.71 37.59,77.72 30.23,76.71 23.6,90.88 30.23,80.77 22.86,81.79
  pour Bottom (isolate 0.305, rank 2): 15.24,98.55 15.24,94.49 22.48,87.25 22.48,73.91 21.72,73.15 19.56,73.15 19.05,72.64 19.05,66.93 38.35,66.93 38.35,78.36 36.45,80.26 32.21,80.26 30.86,81.61 30.86,98.55
  pour Top (isolate 0.305, rank 2): 15.24,98.55 15.24,94.49 22.48,87.25 22.48,73.91 21.72,73.15 19.56,73.15 19.05,72.64 19.05,66.93 38.35,66.93 38.35,78.36 36.45,80.26 32.2,80.26 30.86,81.6 30.86,98.55
I2C_SCL  (via drill 0.36)
  Top 0.254: Z1.B26 53.57,57.38 36.85,57.38 36.58,57.66 | 35.94,57.66 U3.16
  Top 0.305: 36.58,57.66 36.45,57.78 U3.16 33.53,57.78 v33.07,57.33
  Bottom 0.305: v33.07,57.33 31.27,55.52 31.27,46.74 30.35,45.82 17.22,45.82 14.43,43.03 14.43,40.34 13.31,39.22 2.64,39.22 1.93,38.51 1.93,16.38 3.05,15.27 J11.3
I2C_SDA  (via drill 0.36)
  Top 0.254: Z1.B28 53.57,56.92 36.85,56.92 36.58,56.64 35.94,56.64 U3.15
  Top 0.305: U3.15 31.09,56.52 v31.04,56.57
  Bottom 0.305: J11.2 3.12,12.72 1.37,14.48 1.37,38.81 2.34,39.78 13.01,39.78 13.82,40.59 13.82,43.28 16.92,46.38 30.05,46.38 30.71,47.04 30.71,56.24 v31.04,56.57
LGND  (via drill 0.36)
  Top 0.305: 39.29,82.03 LED2.C LED1.C LED4.C LED7.C LED5.C LED6.C | 0.46,24.64 0.46,6.4 1.65,5.21 J8.2 8.76,5.21 v11.76,8.2 | 0.46,24.64 LED8.C | v39.29,76.96 39.29,82.03 | 39.29,82.03 LED11.C LED3.C LED10.C | v0.76,45.34 0.46,45.03 0.46,24.64 | LED9.C 50.8,35.81 51.05,36.07 v51.56,36.07 | LED12.C 82.55,21.05 82.55,20.32 82.04,19.81 v80.52,19.81
  Bottom 0.305: v39.29,76.96 39.29,66.85 38.61,66.17 1.65,66.17 0.76,65.28 v0.76,45.34 | v51.56,36.07 51.56,26.16 54.61,23.11 54.61,19.3 | v11.76,8.2 53.11,8.2 54.61,9.7 54.61,19.3 | v80.52,19.81 74.42,19.81 73.91,20.32 64.52,20.32 62.48,22.35 59.94,22.35 59.44,21.84 59.44,20.07 58.67,19.3 54.61,19.3
N$1
  Top 1.27: J1.RED 81.16,94.1 J4.1
N$2
  Top 0.305: R17.1 LED4.A
N$4
  Top 0.508: U2.1 81.29,72.57 C13.1 D5.C
N$5
  Top 1.27: F11.1 88.12,90.09 81.78,90.09 D1.C
N$6
  Top 0.508: U8.4 71.21,49.94 C23.1
N$7
  Top 0.305: Q2.P$6 50.97,21.42 51.56,20.83 54.1,20.83 54.69,21.41 R7.1 55.05,23.24 55.37,23.24 55.83,23.7 55.83,25.45 54.74,26.54 50.29,26.54 49.07,25.32 Q2.P$3
N$9
  Top 0.406: J10.4 F5.1
N$10
  Top 0.406: J9.4 F6.1
N$11
  Top 0.305: F4.1 63.5,8.27 J12.4
N$12
  Top 0.305: Q1.P$6 28.18,88.97 27.69,89.46 26.62,89.46 26.27,89.8 Q1.P$3 | 30.35,88.35 R5.1
  Top 0.508: Q1.P$6 30.35,88.35
N$13
  Top 0.508: 65.86,76.07 U9.5 65.81,74.07 65.79,74.04 | 65.86,76.07 65.86,79.6 C24.+ | C18.1 65.86,76.07
  Top 0.61: 65.86,79.6 69.12,79.6 JP8.2 | 65.79,74.04 62.48,74.04 62.23,74.3 JP2.2 62.23,77.85 61.98,78.11 JP7.1 61.41,79.81 5V.TP
N$15
  Top 0.305: R24.1 LED9.A
N$16
  Top 0.305: R16.1 LED3.A
N$17
  Top 0.406: J14.4 F9.1
N$18
  Top 0.508: J3.1 32.91,96.22 F1.2
N$19
  Top 0.508: J7.1 22.75,96.22 F2.2
N$20
  Top 0.305: R15.1 LED2.A
N$21
  Top 0.508: J6.1 42.68,96.22 F7.2
N$22
  Top 0.508: J5.1 52.84,96.22 F8.2
N$23
  Top 0.305: R14.1 LED1.A
N$24
  Top 0.508: 50.14,17.93 L3.2 | C9.1 50.06,18.01 L3.2 | Q2.P$4 49.07,19 L3.2
N$25  (via drill 0.41 pad 0.3, 0.41 pad 0.61)
  Top 0.305: Q3.P$3 93.66,69.31 | R11.1 93.66,68.45 93.66,68.78 93.66,69.31 | Q3.P$6 91.75,72.66 91.17,72.66 v90.73,72.21 | v93.67,69.32 93.66,69.31
  Bottom 0.305: v93.67,69.32 92.35,69.32 90.73,70.94 v90.73,72.21
N$26
  Top 0.305: J2.1 10.16,95.5 11.26,94.4 F3.1
N$27
  Top 0.305: R31.1 LED12.A
N$28
  Top 0.508: R13.1 64.13,40.4 Q4.P$3 62.62,39.64 62.23,39.24 62.23,38.1 61.87,37.74 Q4.P$6
N$29
  Top 0.61: U2.5 84.84,75.82 85.34,76.33 86.61,76.33 88.27,77.98 | 88.27,77.98 C12.1 | 88.27,77.98 D12.C
N$30
  Top 0.61: D4.C 86.03,77.85 83.9,77.85 | L5.1 83.9,82.3 83.9,77.85 | 83.9,77.85 U2.6 83.9,74.37 83.57,74.04 81.5,74.04 C13.2
N$31
  Top 0.508: 87.61,46.27 C4.2 89.66,45.47 89.66,47.5 | R3.2 89.69,49.51 89.66,49.53 89.66,49.28 | 87.96,49.53 U1.3 | 89.66,47.5 87.61,47.5 R2.1 | 89.66,47.5 89.66,49.28 | 89.66,49.28 88.14,49.28
  Top 0.61: 87.61,47.5 87.61,46.27 | 87.96,47.64 R2.1 87.63,47.31 87.63,48.26 87.96,48.59 87.96,49.53
  pour Top (isolate 0.254): 88.04,48.41 88.04,49.17 88.14,49.28 90.37,49.28 90.37,44.96 87.53,44.96 87.63,48.01
N$32
  Top 0.457: 67.39,49.73 U8.5
  Top 0.508: U8.5 67.46,51.68 C6.1 67.32,54.61 | 67.32,54.61 67.32,57.12 C7.+ | JP9.2 67.32,54.61
  Top 0.61: 67.39,49.73 64.59,49.73 64.26,50.04 JP6.1 64.26,53.59 64.01,53.85 JP3.1 63.44,56.46 3V3.TP
N$33
  Top 0.508: U2.3 85.78,72.21
  Top 0.61: 85.78,72.03 85.78,70.66 85.51,70.39 R20.1 C14.2 | 85.78,72.03 85.78,72.21 | 85.78,72.03 87.55,72.03
  pour Top (isolate 0.305): 85.65,72.19 88.62,72.19 88.62,66.95 85.65,66.95
N$40  (1 unrouted)
N$43
  Top 0.508: Q5.P$6 97.03,46.6 96.77,46.86 95.13,46.86 | 95.13,46.86 Q5.P$3 | R12.1 93.61,46.86 95.13,46.86
N$44
  Top 0.508: R12.2 93.56,49.02 96.08,49.02
  Top 0.61: Q5.P$2 96.08,49.02 96.08,49.86 96.53,50.31 F10.2
N$45
  Top 0.61: U1.5 87.02,53.24 87.38,53.59 88.95,53.59 89.71,54.36 C1.1 91.61,55.66 D11.C
N$46
  Top 0.305: U1.4 90.16,52.4 R33.1
N$47
  Top 0.305: J11.4 6.07,17.8 6.66,17.22 6.66,16.28 7.61,15.33 F16.1
N$48
  Top 0.305: U2.4 87.54,75.01 R35.1
N$49
  Top 0.305: R35.2 90.16,75.58 90.21,75.58 91.14,74.65 93.62,74.65 93.62,74.55 93.69,74.55
  Top 0.61: D12.A 93.69,77.91 R34.2 93.69,74.55 93.69,72.64 Q3.P$4
N$50
  Top 0.305: J11.5 6.41,20.34 F15.1
N$51
  Top 0.305: R26.1 LED11.A
N$53
  Top 0.254: LED10.A R25.1
N$54
  Top 0.508: U9.4 69.71,74.07 C17.1
N$78
  Top 0.61: D2.C 87.73,54.61 86.08,54.61 | 86.08,54.61 U1.6 86.08,51.79 85.85,51.56 83.22,51.56 C2.2 | 86.08,54.61 86.08,57.53 L1.1
N$108
  Top 0.305: R23.1 5.88,24.57
  Top 0.406: 5.88,24.57 LED8.A
N$109
  Top 0.305: R22.1 LED7.A
N$110
  Top 0.305: R19.1 LED6.A
N$111
  Top 0.305: R18.1 LED5.A
N$117
  Top 0.508: U1.1 83.72,49.96 C2.1 83.23,49.85 D3.C
RADIO_3V3
  Top 0.305: 9.91,24.51 10.26,24.23 10.26,22.1 10.26,22.04 | 10.26,22.04 10.26,19.66 11.14,18.78 18.16,18.78 | RADIO_VCC.TP 10.26,22.04
  Top 0.406: R23.2 9.91,24.51
  Top 0.508: U$8.3V3-1 18.16,26.04 | 18.16,26.04 18.16,18.78 19.01,17.93 47.14,17.93 | R29.2 18.9,26.04 18.16,26.04 | C11.1 47.14,17.93 | 47.14,17.93 L3.1
  Top 0.813: U$8.3V3-2 U$8.3V3-1
RADIO_!RST  (via drill 0.36)
  Top 0.305: U$8.RESET 18.9,31.09 | 18.9,31.09 R29.1 | 18.9,31.09 18.9,35.79 20.5,37.39 32.31,37.39 v32.64,37.72
  Bottom 0.305: v32.64,37.72 33.17,38.25 33.17,41.81 34.29,42.93 Z1.C43
RADIO_CSN  (via drill 0.36 pad 0.41)
  Top 0.305: U$8.CSN 41.15,29.84 40.13,30.86 v40.13,32.51 40.13,38.1 39.17,39.06 30.79,39.06 Z1.C48
  Bottom 0.305: J13.2 4.52,29.46 5.41,30.35 5.41,30.99 6.43,32 18.54,32 19.68,33.15 39.5,33.15 v40.13,32.51
RADIO_EN  (via drill 0.36)
  Top 0.305: 52.21,25.02 R6.2 51.46,24.57 | Q2.P$1 50.93,24.04 51.46,24.57 | v51.31,25.15 51.46,25 51.46,24.57 | v50.8,27.43 R24.2 54.42,28.87 JP11.2
  Bottom 0.305: Z1.B30 54.61,52.83 53.85,52.07 50.8,52.07 49.78,51.05 49.78,28.45 v50.8,27.43 50.8,25.65 v51.31,25.15
RADIO_GND  (via drill 0.41)
  other vias: 11.81,19.94 16.38,19.94 11.81,35.94 16.38,35.94 46.86,35.94 42.29,19.94 46.86,19.94 17.2,25.07 44.83,11.05 47.24,9.02 47.24,2.92 15.24,2.92 45.49,13.69 18.41,36.45 20.95,36.45 23.5,36.45 26.04,36.45 28.57,36.45 31.11,36.45 33.66,36.45 36.2,36.45 20.95,30.61 23.5,30.61 26.04,30.61 28.57,30.61 31.11,30.61 33.66,30.61 36.2,30.61 20.95,18.92 23.5,18.92 26.04,18.92 28.57,18.92 31.11,18.92 33.66,18.92 36.2,18.92 38.73,18.92 41.27,18.92 43.81,18.92 19.94,21.46 19.94,24 19.94,26.54 20.95,15.62 23.5,15.62 26.04,15.62 28.57,15.62 31.11,15.62 33.66,15.62 36.2,15.62 38.73,15.62 41.27,15.62 43.81,15.62 15.88,17.53 13.34,17.53 18.41,16.26
  pour Top (isolate 0.305): 10.92,37.34 47.88,37.34 47.88,2.29 10.92,2.29
  pour Bottom (isolate 0.305): 10.92,37.34 47.88,37.34 47.88,2.29 10.92,2.29
RADIO_GPIO0  (via drill 0.36)
  Top 0.305: U$8.GPIO0 40.64,27.3 38.61,29.34 38.61,31.75 | 38.61,31.75 38.61,37.08 37.19,38.51 30.45,38.51 29.46,39.5 22.73,39.5 Z1.C54 | v38.58,32.36 38.61,31.75
  Bottom 0.305: J13.1 4.7,26.92 5.97,28.19 5.97,30.48 6.86,31.37 19.05,31.37 20.04,32.36 v38.58,32.36
RADIO_GPIO2  (via drill 0.36 pad 0.41)
  Top 0.305: U$8.GPIO2 40.89,28.57 39.37,30.1 39.37,37.85 38.99,38.23 v38.73,38.23
  Bottom 0.305: Z1.C42 36.83,38.99 37.59,38.23 v38.73,38.23
RADIO_SPI_CLK  (via drill 0.36 pad 0.41)
  Top 0.305: Z1.B34 53.09,46.74 53.09,40.03 51.92,38.86 43.31,38.86 40.89,36.45 v40.89,33.15 40.89,32 41.78,31.11 U$8.SCLK
  Bottom 0.305: v40.89,33.15 40.13,33.91 19.18,33.91 17.91,32.64 5.46,32.64 4.83,32 J13.3
RADIO_SPI_MISO  (via drill 0.36 pad 0.41)
  Top 0.305: 43.18,35.43 U$8.MISO | 43.18,35.43 43.18,36.45 44.2,37.59 52.32,37.59 54.1,39.37 54.1,42.67 Z1.B40 | 43.18,35.43 v42.42,35.43
  Bottom 0.305: v42.42,35.43 17.91,35.43 16.38,33.91 6.48,33.91 5.84,34.54 5.84,36.07 4.83,37.08 J13.5
RADIO_SPI_MOSI  (via drill 0.36 pad 0.41)
  Top 0.305: Z1.B36 53.59,44.7 53.59,39.67 52.15,38.23 43.84,38.23 41.63,36.02 v41.63,34.67 41.63,32.92 42.16,32.38 U$8.MOSI
  Bottom 0.305: v41.63,34.67 18.54,34.67 17.14,33.27 5.84,33.27 4.57,34.54 J13.4
RAIN  (via drill 0.36)
  Top 0.305: J2.2 7.62,92.2 6.35,90.93 R1.2 | R16.2 36.85,90.14 36.07,90.93 v35.81,90.93 | 33.53,98.96 43,98.96 44.2,97.77 v44.2,97.03 | 33.53,98.96 13.97,98.96 v13.54,98.53 | v33.53,97.66 33.53,98.96
  Bottom 0.305: v33.53,97.66 33.53,91.95 34.54,90.93 v35.81,90.93 | v13.54,98.53 8.1,98.53 7.62,98.04 J2.2 | Z1.C49 26.67,43.94 27.94,45.21 41.91,45.21 43.69,46.99 43.69,96.52 v44.2,97.03
RS4851_N
  Top 0.305: U4.7 70.31,13.34 70.65,12.99 70.65,10.54 R30.1 69.85,9.74 J10.2
RS4851_P
  Top 0.305: U4.6 70.03,14.61 71.59,13.04 71.59,10.54 R30.2 72.39,9.74 J10.3
RS4852_N
  Top 0.305: J9.2 81.28,9.7 81.74,10.16 R27.1 arc90 82.08,10.54 82.08,12.99 81.74,13.34 U5.7
RS4852_P
  Top 0.305: J9.3 83.82,9.7 83.36,10.16 R27.2 83.4,10.33 83.06,10.67 83.06,13.13 81.58,14.61 U5.6
RS4853_N
  Top 0.305: J14.2 92.71,9.7 93.17,10.16 R32.1 93.51,10.54 93.51,12.99 93.17,13.34 U6.7
RS4853_P
  Top 0.305: J14.3 95.25,9.7 94.79,10.16 R32.2 94.45,10.54 94.45,13.17 93.01,14.61 U6.6
SENSE_3V3  (via drill 0.36, 0.41 pad 0.61)
  Top 0.305: v56.13,39.62 56.13,35.69 60.96,30.86 60.96,20.61 | U5.8 v80.09,10.92 | v91.52,10.92 U6.8 | U4.8 v68.66,10.92 | 53.85,82.68 53.98,82.8 | v9.09,12.42 7.89,13.63 F16.2 | 64.59,14.66 U11.14 57.73,14.66 arc-90 57.66,14.73 | 64.59,14.66 65.28,13.97 65.28,12.45 65.67,12.05 C20.1 | 64.59,14.66 64.52,14.73 64.52,18.8 64,19.32 U10.2 61.97,19.32 60.96,20.32 60.96,20.61 | 57.66,14.73 57.66,15.9 55.17,18.39 54.85,18.39 R38.2 R28.2 | 57.66,14.73 57.66,9.14 | 57.66,9.14 v57.66,7.54 | 60.96,20.61 U10.4 U10.5 | R39.2 57.66,9.14
  Top 0.508: VCC_S.TP 61.98,40.45 Q4.P$4 61.15,39.62 v59.94,39.62 | v56.13,39.62 56.13,71.25 53.98,73.41 53.98,82.8 53.98,87.69 | 53.98,87.69 53.98,93.38 F8.1 52.87,94.4 52.58,94.11 42.67,94.11 | 91.52,12.05 U6.8 89.43,12.06 C22.1 | U4.8 66.57,12.06 C20.1 | U5.8 78,12.06 C21.1 | F1.1 32.93,94.4 | 32.93,94.4 32.64,94.11 22.64,94.11 F2.1 | 32.93,94.4 33.23,94.11 42.67,94.11 | F7.1 42.67,94.27 42.67,94.11 | R19.2 53.98,87.69
  Bottom 0.305: v91.52,10.92 v80.09,10.92 v68.66,10.92 68.58,11.05 | v57.66,7.54 57.07,6.96 10.97,6.96 9.7,8.23 9.7,11.81 v9.09,12.42
  Bottom 0.508: v59.94,39.62 v56.13,39.62
SENSE_5V  (via drill 0.36, 0.41, 0.41 pad 0.61, 0.46)
  Top 0.305: R22.2 48.28,89.31 48.77,89.79 v49.4,89.79 | v9.91,15.49 8.22,17.18 F15.2
  Top 0.508: v55.75,86.74 v55.75,75.18 55.75,74.17 57.91,72.01 57.91,36.45 60.33,34.04 v88.59,34.04 | v65.89,10.21 65.48,10.62 63.98,10.62 64.1,10.76 F4.2 | F5.2 74.92,9.75 v73.38,9.75 | F6.2 86.35,9.75 v84.81,9.75 | F9.2 97.78,9.75 v96.24,9.75 | H1.3 64.12,91.42 61.98,89.28 61.98,87.71 61.01,86.74 v57.66,86.74
  Top 0.61: JP7.2 59.94,78.11 59.69,77.85 JP2.1
  Bottom 0.305: v49.4,89.79 54.48,89.79 55.75,88.52 v55.75,86.74 | 65.89,9.75 64.41,8.28 57.15,8.28 56.39,7.52 11.28,7.52 10.26,8.53 10.26,15.14 v9.91,15.49
  Bottom 0.508: JP2.1 59.66,75.18 v55.75,75.18 | v57.66,86.74 v55.75,86.74 | v65.89,10.21 65.89,9.75 v73.38,9.75 v84.81,9.75 v96.24,9.75 98.86,9.75 99.42,10.31 99.42,22.35 97.38,24.38 91.19,24.38 89.92,25.65 89.92,32.72 v88.59,34.04
SENSE_12V  (via drill 0.36)
  Top 0.305: R17.2 46.25,89.56 v47.24,90.55
  Top 0.508: 12V_OUT.RED 90.54,37.71 87.76,34.92 60.71,34.92 58.8,36.83 58.8,72.42 56.64,74.57 56.64,87.43 v56.84,87.63 60.64,87.63 61.2,88.19 61.2,90.52 H1.4
  Top 0.61: Q5.P$4 95.13,39.02 12V_OUT.RED
  Bottom 0.305: v47.24,90.55 54.61,90.55 56.84,88.32 v56.84,87.63
SENSE_EN  (via drill 0.36)
  Top 0.305: Q3.P$1 91.76,69.54 91.44,69.22 v91.19,69.22 | Q5.P$1 97.03,48.9 97.29,49.15 v97.79,49.15 | Q1.P$1 28.18,89.86 28.57,89.46 v29.06,89.46 | R26.2 38.89,90.4 37.34,91.95 v32.69,91.95 | Q4.P$1 63.37,36.95 62.99,36.58 v61.59,36.58 | v98.42,98.45 97.36,99.52 59.08,99.52 58.12,98.56 H1.6 | Z1.B32 53.34,52.07 48.93,52.07 R10.2 | U10.10 62.35,24.52 61.59,25.27 v61.59,32.13
  Bottom 0.305: 99.52,68.2 91.69,68.2 91.19,68.71 v91.19,69.22 | v29.06,89.46 31.85,89.46 32.51,90.12 32.51,91.95 | 32.51,91.95 32.51,97.99 33.25,98.73 56.57,98.73 58.12,97.18 H1.6 | v32.69,91.95 32.51,91.95 | Z1.B32 57.15,50.8 60.96,46.99 60.96,41.71 | 60.96,41.71 60.96,37.21 v61.59,36.58 v61.59,32.13 | 60.96,41.71 71.37,41.71 | 71.37,41.71 95.84,41.71 97.79,43.65 v97.79,49.15 99.52,50.88 99.52,68.2 | 99.52,68.2 99.52,97.35 v98.42,98.45 | JP1.2 71.37,41.71
TTL_RX
  Top 0.305: 58.42,6.6 58.42,10.92 58.9,11.4 U11.9 | 58.42,6.6 J12.2 | R39.1 55.27,8.65 55.27,8.33 57,6.6 58.42,6.6
TTL_TX  (via drill 0.36)
  Top 0.305: v60.91,9.09 60.96,9.04 J12.3 | v61.98,21.59 62.3,21.91 U10.6
  Bottom 0.305: v60.91,9.09 60.91,20.52 v61.98,21.59
TX_EN  (via drill 0.36)
  Top 0.254: 58.06,19.96 58.32,19.96 58.67,20.32 v58.67,20.57
  Top 0.305: Z1.C46 32.77,39.62 v51.56,39.62 | v53.21,37.21 53.72,36.7 53.72,35.18 58.67,30.23 v58.67,25.4 | U10.18 58.06,19.96 | R31.2 v74.42,21.08
  Bottom 0.305: v51.56,39.62 52.45,38.73 52.45,37.97 v53.21,37.21 | v58.67,25.4 58.67,22.91 | 58.67,22.91 v58.67,20.57 | 58.67,22.91 62.79,22.91 64.82,20.88 74.22,20.88 v74.42,21.08
TX_EN_BUFF
  Top 0.254: U6.3 U6.2 | U5.3 U5.2
  Top 0.305: U4.2 U4.3 | U6.3 95.53,14.61 93.62,16.51 87.88,16.51 87.53,16.15 87.53,15.24 86.89,14.61 U5.3 84.2,14.61 82.3,16.51 76.71,16.51 74.8,14.61 U4.3 | U10.3 70.2,19.96 71.63,18.54 71.63,15.49 72.52,14.61 U4.3
UART1_RX  (via drill 0.36)
  Top 0.305: v54.36,38.35 55.24,37.47 55.24,35.43 60.2,30.48 60.2,20.07 58.8,18.66 U10.20
  Bottom 0.305: Z1.B31 53.59,49.28 53.59,39.12 v54.36,38.35
UART1_RX_BUFF  (via drill 0.36)
  Top 0.305: U11.8 61.54,10.74 v61.72,10.92 61.86,10.79 JP12.2 | v61.72,18.03 62.35,18.66 U10.1
  Bottom 0.305: v61.72,10.92 v61.72,18.03
UART1_TX  (via drill 0.36)
  Top 0.305: v54.23,37.34 54.48,37.08 54.48,35.31 59.44,30.35 59.44,24.89 58.41,23.86 U10.12 U10.13 U10.14 U10.15
  Bottom 0.305: Z1.B33 53.09,47.24 53.09,38.48 v54.23,37.34
USB_5V  (via drill 0.36, 0.41)
  Top 0.305: v18.67,81.53 18.77,81.43 U7.1
  Top 0.508: v15.19,74.88 16.36,73.71 49.35,73.71 50.9,72.16 50.9,62.13 Z1.B23
  Bottom 0.305: X1.VBUS 14.91,81.53 v18.67,81.53
  Bottom 0.508: X1.VBUS 14.73,75.34 v15.19,74.88
USB_D_N
  Top 0.254: U7.3 17.73,80.42
  Top 0.305: Z1.B21 52.2,63.5 53.59,64.9 53.59,72.49 50.39,75.69 17.77,75.69 16.84,76.62 16.84,80.42 | X1.D- 15.06,83.85 16.84,82.07 16.84,80.42 | 17.73,80.42 16.84,80.42
USB_D_P  (via drill 0.36)
  Top 0.305: Z1.B19 52.12,66.04 53.09,67 53.09,72.14 50.09,75.13 17.48,75.13 16.15,76.45 v16.15,77.85 16.15,81.89 15.39,82.65 13.95,82.65 X1.D+ | U7.5 18.77,78.08 v18.54,77.85
  Bottom 0.305: v18.54,77.85 v16.15,77.85
USB_GND  (via drill 0.36)
  Top 0.305: U7.4 v17.75,76.94
  Top 0.508: Z1.B17 52.07,72.14 49.73,74.47 16.99,74.47 v16.08,75.39 12.75,78.72 X1.GND
  Bottom 0.305: v17.75,76.94 v16.08,75.39
VBAT_B  (via drill 0.41 pad 0.61)  (1 unrouted)
  Top 0.254: 11.02,44.96 10.4,44.34
  Top 0.508: U3.14 33.78,55.24 33.27,54.74 33.27,47.35 31.14,45.21 11.28,45.21 v9.47,43.41
  Top 0.61: U$3.V+@1 10.4,44.34 v11.51,45.44 | v9.47,43.41 9.47,42.6 10.92,41.15 | v9.45,69.88 | v9.45,69.88 U$3.V+@2
  Bottom 0.61: v7.44,45.44 v9.47,43.41 | v7.44,41.38 v9.47,43.41 | v9.47,43.41 v11.51,45.44 | v11.5,41.38 v11.51,41.38 U$3.V+@1 v9.47,43.4 v9.47,43.41 | v7.42,71.91 v9.45,69.88 | v7.42,67.84 v9.45,69.88 | v9.45,69.88 v11.48,71.91 | v11.48,67.84 v9.45,69.88
VCC  (via drill 0.41)
  Top 0.305: R25.2 34.04,89.36 32.92,90.47 v31.7,90.47
  Top 0.508: Q1.P$2 27.23,91.69 29.03,91.69 30.35,90.37 R5.2 31.41,90.18 v31.7,90.47
  Top 1.27: J4.2 76.45,91.57 D1.A
  Bottom 0.508: v31.7,90.47 31.7,98.2 32.94,99.44 75.46,99.44 76.45,98.45 J4.2
VCC_HP2_SW1
  Top 0.508: R8.2 26.29,88.35 Q1.P$4

## Text on the board
bPlace: RAIN / D1 / D2 / BATVOLTS / BATVOLTS_DIV | VCC / 3V3 / SENSE_EN / SENSE_3V3 / SENSE_5V / SENSE_12V | ASSEMBLY / DATE | ADC1_IN / ADC1_PWR / ADC2_IN / ADC2_PWR / RTC | TTL_S / RS485_1 / RS485_2 / RS485_3 | RADIO_EN / RADIO_3V3 / CC1120
tNames: ALT PWR | GND | mountainsensing.org | MS2 V1.0 | Graeme Bragg / Kirk Martinez / Phil Basford / ECS / University of / Southampton